# EAGLE design AlienWhoopF7 (EAGLE 9.0.0)
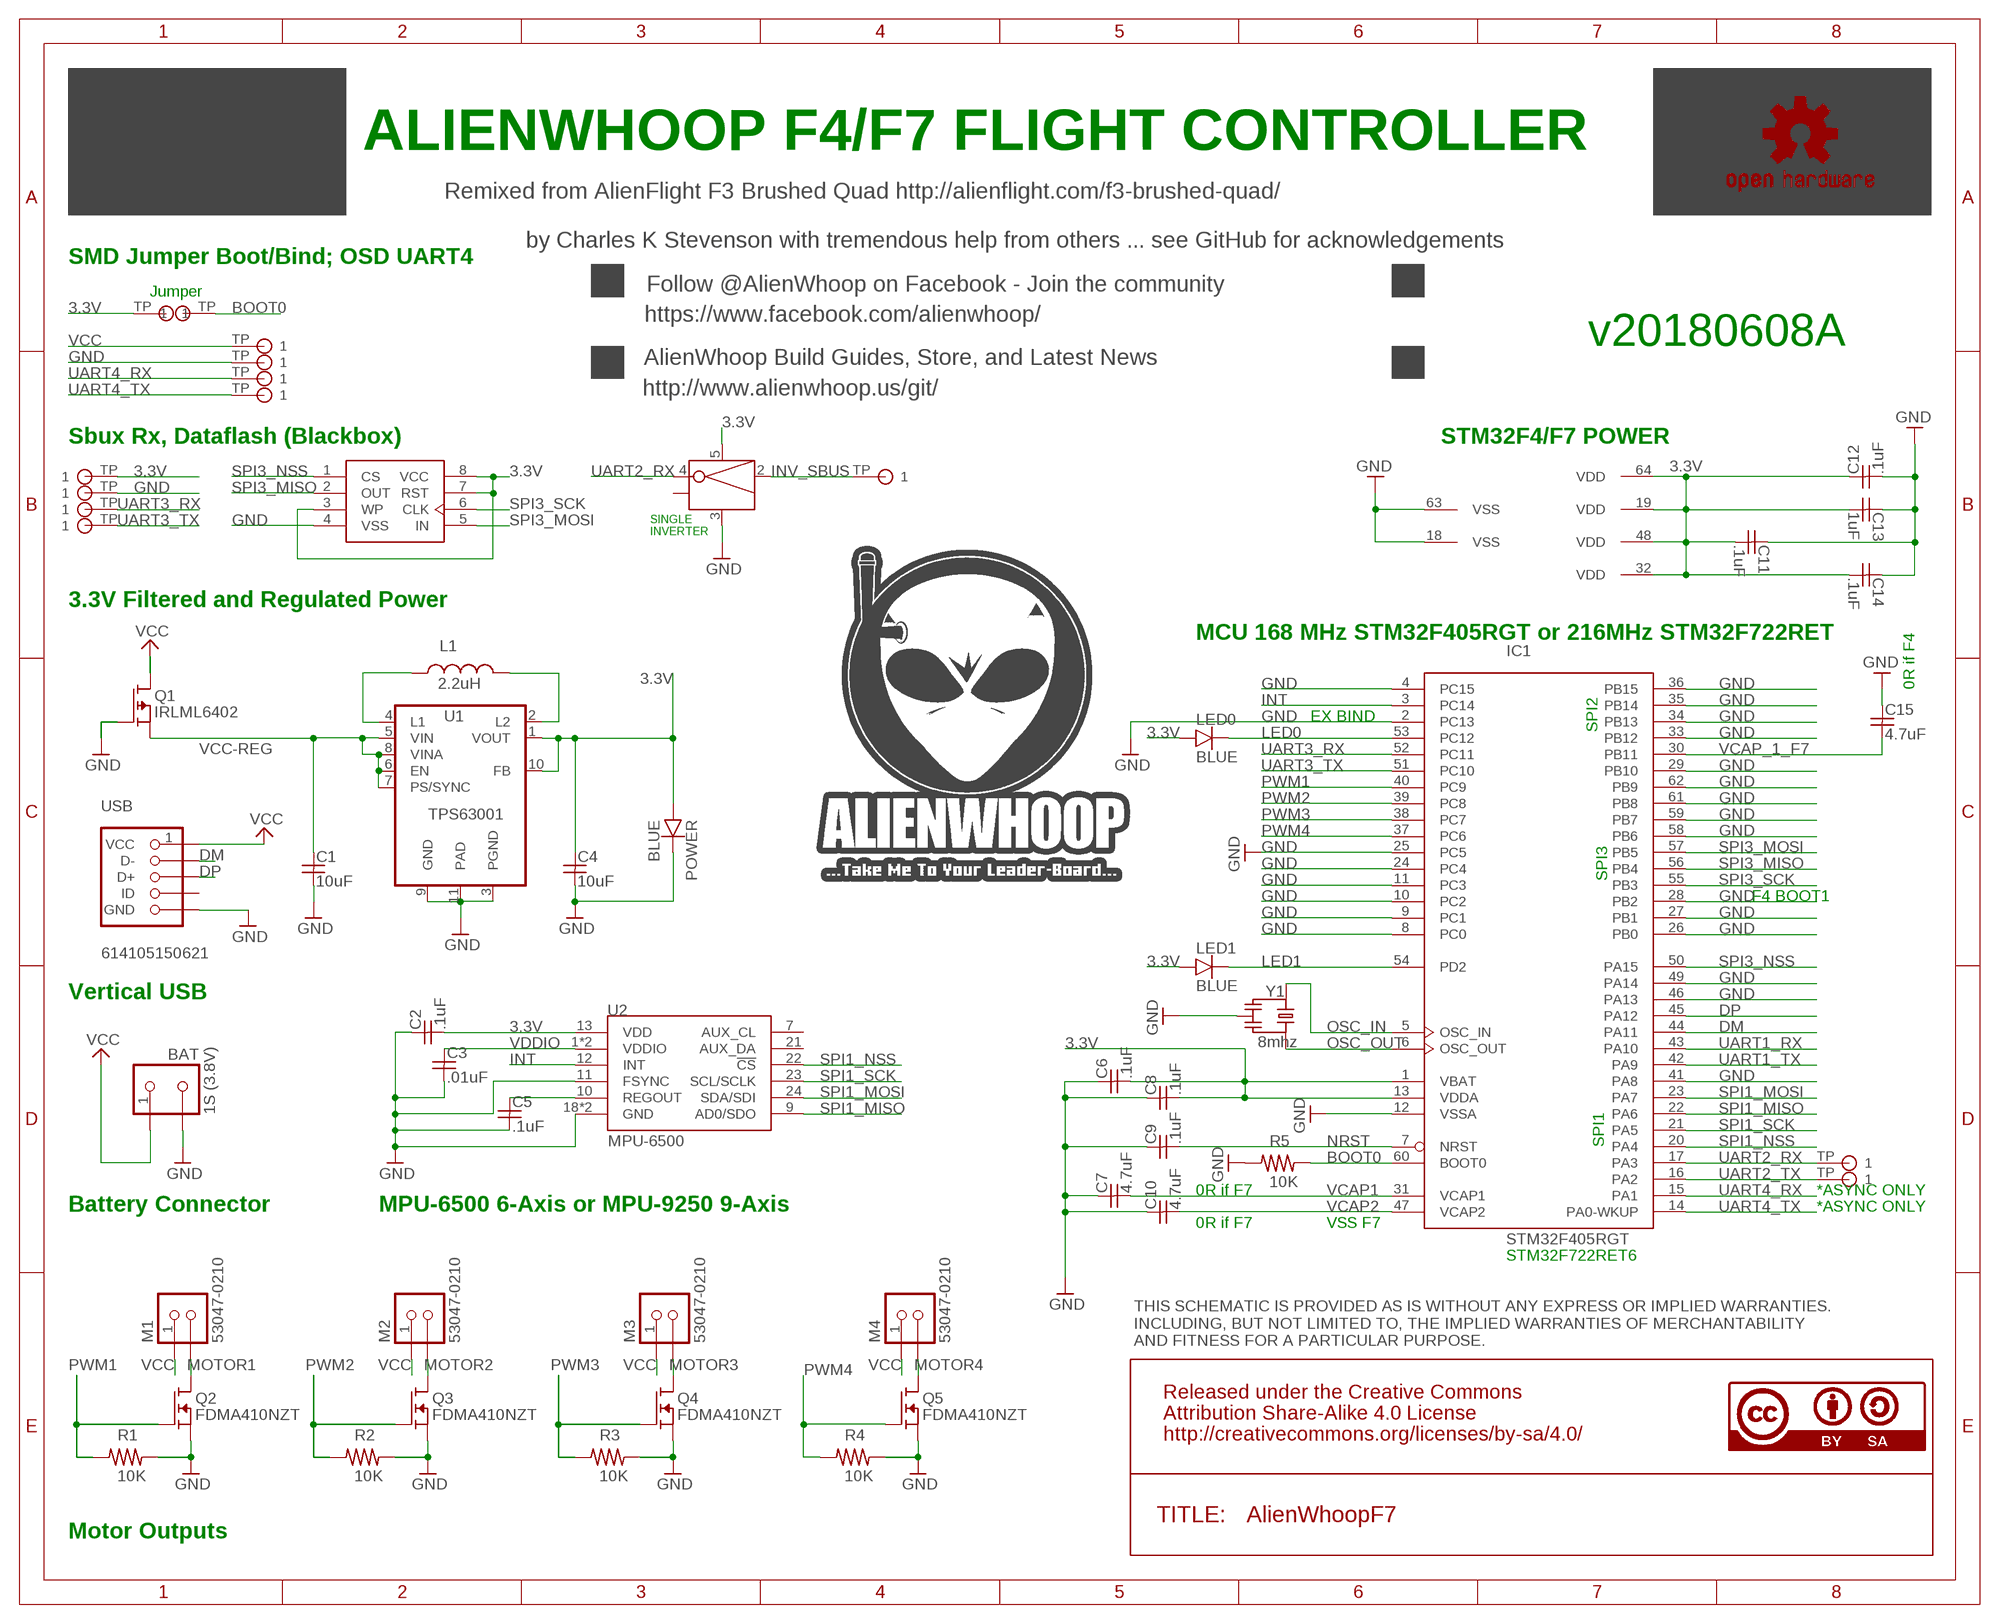
[diagram p0: schematic, sheet 1]

## Parts
3.3V  TESTPAD  [TESTPAD]
3V3  TESTPAD  [TESTPAD]
BAT  1S (3.8V)  JST-PH-BAT  [S2B-PH-K-S]
BOOT  TESTPAD  [TESTPAD]
C1  10uF  CAPACITOR10UF  [YUDEN-CAP-0805]
C2  .1uF  CAPACITOR.1UF  [MUR-CAP-0603]
C3  .01uF  CAPACITOR.01UF  [MUR-CAP-0603]
C4  10uF  CAPACITOR10UF  [YUDEN-CAP-0805]
C5  .1uF  CAPACITOR.1UF  [MUR-CAP-0603]
C6  .1uF  CAPACITOR.1UF  [MUR-CAP-0603]
C7  4.7uF  CAPACITOR4.7UF  [MUR-CAP-0603]
C8  .1uF  CAPACITOR.1UF  [MUR-CAP-0603]
C9  .1uF  CAPACITOR.1UF  [MUR-CAP-0603]
C10  4.7uF  CAPACITOR4.7UF  [MUR-CAP-0603]
C11  .1uF  CAPACITOR.1UF  [MUR-CAP-0603]
C12  .1uF  CAPACITOR.1UF  [MUR-CAP-0603]
C13  1uF  CAPACITOR1UF  [MUR-CAP-0603]
C14  .1uF  CAPACITOR.1UF  [MUR-CAP-0603]
C15  4.7uF  CAPACITOR4.7UF  [MUR-CAP-0603]
GND  TESTPAD  [TESTPAD]
GND@1  TESTPAD  [TESTPAD]
IC1  STM32F405RGT  [LQFP64]
L1  2.2uH  DFE201612E-2R2M-P2  [DFE201612E-2R2M-P2]
LED0  BLUE  SMD-CHIP-LED-0805  [SMD-CHIP-LED-0805]
LED1  BLUE  SMD-CHIP-LED-0805  [SMD-CHIP-LED-0805]
LOGO3  OSHW-LOGOS  [OSHW-LOGO-S]
M1  53047-0210  PICO-1.25-MOTOR  [PICO-53047-02]
M2  53047-0210  PICO-1.25-MOTOR  [PICO-53047-02]
M3  53047-0210  PICO-1.25-MOTOR  [PICO-53047-02]
M4  53047-0210  PICO-1.25-MOTOR  [PICO-53047-02]
POWER  BLUE  SMD-CHIP-LED-0805  [SMD-CHIP-LED-0805]
Q1  IRLML6402  MOSFET-P  [SOT-23]
Q2  FDMA410NZT  FDMA410NZ  [MICROFET-2X2]
Q3  FDMA410NZT  FDMA410NZ  [MICROFET-2X2]
Q4  FDMA410NZT  FDMA410NZ  [MICROFET-2X2]
Q5  FDMA410NZT  FDMA410NZ  [MICROFET-2X2]
R1  10K  RESISTOR10K  [VISH-RES-0603]
R2  10K  RESISTOR10K  [VISH-RES-0603]
R3  10K  RESISTOR10K  [VISH-RES-0603]
R4  10K  RESISTOR10K  [VISH-RES-0603]
R5  10K  RESISTOR10K  [VISH-RES-0603]
RX2  TESTPAD  [TESTPAD]
RX2/INV  TESTPAD  [TESTPAD]
RX3  TESTPAD  [TESTPAD]
RX4  TESTPAD  [TESTPAD]
TX2  TESTPAD  [TESTPAD]
TX3  TESTPAD  [TESTPAD]
TX4  TESTPAD  [TESTPAD]
U1  TPS63001  TPS630XX-TPS63001  [VSON-N10]
U2  MPU-6500  MPU-9250  [QFN24_PAD]
U3  MX25L6406EM2I-12G  M25P32  [M25P32]
U4  SN74LVC1G04DBVR  SN74LVC1G04  [SOT23-5]
USB  614105150621  MICROUSBUSB-BFPV  [USB-BFPV]
VCC@1  TESTPAD  [TESTPAD]
Y1  8mhz  RESONATOR8MHZ  [RESONATOR_8]

## Nets
3.3V: 3.3V.TP 3V3.TP C2.2 C4.1 C6.2 C8.2 C11.2 C12.1 C13.2 C14.2 IC1.1(VBAT) IC1.13(VDDA) IC1.19(VDD) IC1.32(VDD) IC1.48(VDD) IC1.64(VDD) LED0.A LED1.A POWER.A U1.1(VOUT) U1.10(FB) U2.13(VDD) U3.3(WP) U3.7(RST) U3.8(VCC) U4.5(VCC)
BOOT0: BOOT.TP IC1.60(BOOT0) R5.1
DM: IC1.44(PA11) USB.2(D-)
DP: IC1.45(PA12) USB.3(D+)
GND: BAT.2 C1.2 C2.1 C3.2 C4.2 C5.2 C6.1 C7.1 C8.1 C9.1 C10.1 C11.1 C12.2 C13.1 C14.1 C15.1 GND.TP GND@1.TP IC1.2(PC13) IC1.4(PC15) IC1.8(PC0) IC1.9(PC1) IC1.10(PC2) IC1.11(PC3) IC1.12(VSSA) IC1.18(VSS) IC1.24(PC4) IC1.25(PC5) IC1.26(PB0) IC1.27(PB1) IC1.28(PB2) IC1.29(PB10) IC1.33(PB12) IC1.34(PB13) IC1.35(PB14) IC1.36(PB15) IC1.41(PA8) IC1.46(PA13) IC1.49(PA14) IC1.58(PB6) IC1.59(PB7) IC1.61(PB8) IC1.62(PB9) IC1.63(VSS) POWER.C Q1.1(G) Q2.S Q2.S1(S) Q3.S Q3.S1(S) Q4.S Q4.S1(S) Q5.S Q5.S1(S) R1.1 R2.1 R3.1 R4.1 R5.2 U1.3(PGND) U1.9(GND) U1.11(PAD) U2.11(FSYNC) U2.18(GND) U2.20(GND) U3.4(VSS) U4.3(GND) USB.5(GND) USB.P$6(GND) USB.P$7(GND) Y1.2
INT: IC1.3(PC14) U2.12(INT)
INV_SBUS: RX2/INV.TP U4.2(A)
L1: L1.P$1 U1.4(L1)
L2: L1.P$2 U1.2(L2)
LED0: IC1.53(PC12) LED0.C
LED1: IC1.54(PD2) LED1.C
MOTOR1: M1.2 Q2.D Q2.D1(D) Q2.D2(D) Q2.D3(D) Q2.D4(D)
MOTOR2: M2.2 Q3.D Q3.D1(D) Q3.D2(D) Q3.D3(D) Q3.D4(D)
MOTOR3: M3.2 Q4.D Q4.D1(D) Q4.D2(D) Q4.D3(D) Q4.D4(D)
MOTOR4: M4.2 Q5.D Q5.D1(D) Q5.D2(D) Q5.D3(D) Q5.D4(D)
NRST: C9.2 IC1.7(NRST)
OSC_IN: IC1.5(OSC_IN) Y1.1
OSC_OUT: IC1.6(OSC_OUT) Y1.3
PWM1: IC1.40(PC9) Q2.G R1.2
PWM2: IC1.39(PC8) Q3.G R2.2
PWM3: IC1.38(PC7) Q4.G R3.2
PWM4: IC1.37(PC6) Q5.G R4.2
REGOUT: C5.1 U2.10(REGOUT)
SPI1_MISO: IC1.22(PA6) U2.9(AD0/SDO)
SPI1_MOSI: IC1.23(PA7) U2.24(SDA/SDI)
SPI1_NSS: IC1.20(PA4) U2.22(!CS)
SPI1_SCK: IC1.21(PA5) U2.23(SCL/SCLK)
SPI3_MISO: IC1.56(PB4) U3.2(OUT)
SPI3_MOSI: IC1.57(PB5) U3.5(IN)
SPI3_NSS: IC1.50(PA15) U3.1(CS)
SPI3_SCK: IC1.55(PB3) U3.6(CLK)
UART1_RX: IC1.43(PA10)
UART1_TX: IC1.42(PA9)
UART2_RX: IC1.17(PA3) RX2.TP U4.4(Y)
UART2_TX: IC1.16(PA2) TX2.TP
UART3_RX: IC1.52(PC11) RX3.TP
UART3_TX: IC1.51(PC10) TX3.TP
UART4_RX: IC1.15(PA1) RX4.TP
UART4_TX: IC1.14(PA0-WKUP) TX4.TP
VCAP1: C7.2 IC1.31(VCAP1)
VCAP2: C10.2 IC1.47(VCAP2)
VCAP_1_F7: C15.2 IC1.30(PB11)
VCC: BAT.1 M1.1 M2.1 M3.1 M4.1 Q1.3(D) USB.1(VCC) VCC@1.TP
VCC-REG: C1.1 Q1.2(S) U1.5(VIN) U1.6(EN) U1.7(PS/SYNC) U1.8(VINA)
VDDIO: C3.1 U2.1(VDDIO) U2.8(VDDIO)
Unconnected: U2.7(AUX_CL) U2.21(AUX_DA) U4.1 USB.4(ID)

## Notes on the sheet
- ALIENWHOOP F4/F7 FLIGHT CONTROLLER
- Remixed from AlienFlight F3 Brushed Quad http://alienflight.com/f3-brushed-quad/
- by Charles K Stevenson with tremendous help from others ... see GitHub for acknowledgements
- SMD Jumper Boot/Bind; OSD UART4
- Follow @AlienWhoop on Facebook - Join the community
- Jumper
- https://www.facebook.com/alienwhoop/
- v20180608A
- AlienWhoop Build Guides, Store, and Latest News
- http://www.alienwhoop.us/git/
- STM32F4/F7 POWER
- Sbux Rx, Dataflash (Blackbox)
- THIRD DRAFT
- 3.3V Filtered and Regulated Power
- MCU 168 MHz STM32F405RGT or 216MHz STM32F722RET
- 0R if F4
- SPI2
- EX BIND
- SPI3
- F4 BOOT1
- Vertical USB
- SPI1
- 0R if F7 | *ASYNC ONLY
- Battery Connector | MPU-6500 6-Axis or MPU-9250 9-Axis | *ASYNC ONLY
- 0R if F7 | VSS F7
- STM32F722RET6
- THIS SCHEMATIC IS PROVIDED AS IS WITHOUT ANY EXPRESS OR IMPLIED WARRANTIES.
  INCLUDING, BUT NOT LIMITED TO, THE IMPLIED WARRANTIES OF MERCHANTABILITY
  AND FITNESS FOR A PARTICULAR PURPOSE.
- Motor Outputs

## Library data of the parts
3.3V 3V3 BOOT GND GND@1 RX2 RX2/INV RX3 RX4 TX2-TX4 VCC@1 = AlienWhoop:TESTPAD: Test pad also can be used for tiny solder pad for signal; BOM: EXCLUDE; DNP: T; PARTNO: TESTPAD
BAT = alienflight:JST-PH-BAT: Battery Connector JST- S2B-PH-K-S View Datasheet <http://www.jst-mfg.com/product/pdf/eng/ePH.pdf> Author: Lance Source: http://alienflight.com License: CC BY SA <creativecommons.org/licenses/by-sa/4.0/>; BOM: EXCLUDE; DNP: T; MF: JST; MPN: S2B-PH-K-S
C1 C4 = alienflight:CAPACITOR: CAPACITORS Murata Datasheet <http://www.murata.com/~/media/webrenewal/support/library/catalog/products/capacitor/mlcc/c02e.ashx?la=en-us> Taiyo Yuden Datasheet <http://www.mouser.com/ds/2/396/mlcc11_hq_e-541564.pdf> Author: Lance Source: http://alienflight.com License: CC BY SA <creativecommons.org/licenses/by-sa/4.0/>; MF: Taiyo Yuden; MPN: JMK212AB7106KG-T
C2 C5 C6 C8 C9 C11 C12 C14 = alienflight:CAPACITOR: CAPACITORS Murata Datasheet <http://www.murata.com/~/media/webrenewal/support/library/catalog/products/capacitor/mlcc/c02e.ashx?la=en-us> Taiyo Yuden Datasheet <http://www.mouser.com/ds/2/396/mlcc11_hq_e-541564.pdf> Author: Lance Source: http://alienflight.com License: CC BY SA <creativecommons.org/licenses/by-sa/4.0/>; MF: Murata; MPN: GRM188R71C104KA01D
C3 = alienflight:CAPACITOR: CAPACITORS Murata Datasheet <http://www.murata.com/~/media/webrenewal/support/library/catalog/products/capacitor/mlcc/c02e.ashx?la=en-us> Taiyo Yuden Datasheet <http://www.mouser.com/ds/2/396/mlcc11_hq_e-541564.pdf> Author: Lance Source: http://alienflight.com License: CC BY SA <creativecommons.org/licenses/by-sa/4.0/>; MF: Murata; MPN: GRM188R71C103KA01D
C7 C10 C15 = alienflight:CAPACITOR: CAPACITORS Murata Datasheet <http://www.murata.com/~/media/webrenewal/support/library/catalog/products/capacitor/mlcc/c02e.ashx?la=en-us> Taiyo Yuden Datasheet <http://www.mouser.com/ds/2/396/mlcc11_hq_e-541564.pdf> Author: Lance Source: http://alienflight.com License: CC BY SA <creativecommons.org/licenses/by-sa/4.0/>; MF: Murata; MPN: GRJ188C70J475KE11D
C13 = alienflight:CAPACITOR: CAPACITORS Murata Datasheet <http://www.murata.com/~/media/webrenewal/support/library/catalog/products/capacitor/mlcc/c02e.ashx?la=en-us> Taiyo Yuden Datasheet <http://www.mouser.com/ds/2/396/mlcc11_hq_e-541564.pdf> Author: Lance Source: http://alienflight.com License: CC BY SA <creativecommons.org/licenses/by-sa/4.0/>; MF: Murata; MPN: GRM188R71C105KA12D
IC1 = micro-stm_v2:STM32F405R*T: ARM 32-bit Cortex™-M3 CPU 168 MHz maximum frequency 1024 Kbytes of Flash memory 192 kbytes of SRAM 51 GPIOs 1.8 to 3.6 V application supply; MPN: STM32F045RGT
L1 = AlienWhoop:DFE201612E-2R2M-P2: Murata Fixed Inductors 0806 2.2uH 20% 2.4A RDC=0.116ohms; PARTNO: DFE201612E-2R2M-P2
LED0 LED1 POWER = alienflight:SMD-CHIP-LED-0805: SMD CHIP LED APHCM2012QBC/D-F01 View Datasheet <https://www.kingbrightusa.com/images/catalog/spec/APHCM2012QBC-D-F01.pdf> Author: Lance Source: http://alienflight.com License: CC BY SA <creativecommons.org/licenses/by-sa/4.0/>; MF: Kingbright; MPN: APHCM2012QBC/D-F01
LOGO3 = SparkFun-Aesthetics:OSHW-LOGO: Open Source Hardware Logo This logo indicates the piece of hardware it is found on incorporates a OSHW license and/or adheres to the definition of open source hardware found here: http://freedomdefined.org/OSHW; BOM: EXCLUDE; DNP: T; PARTNO: OSHW-LOGOS
M1-M4 = alienflight:PICO-1.25-MOTOR: Motor Connector PicoBlade 1.25 53047-02 View Datasheet <http://www.molex.com/webdocs/datasheets/pdf/en-us/0530470210_PCB_HEADERS.pdf> Author: Lance Source: http://alienflight.com License: CC BY SA <creativecommons.org/licenses/by-sa/4.0/>; MF: MOLEX; MPN: 53047-0210
Q1 = alienflight:MOSFET-P: P-Channel MOSFET IRLML6402 Datasheet <http://www.irf.com/product-info/datasheets/data/irlml6402pbf.pdf> Author: Lance Source: Alienflight.com License: CC BY SA <creativecommons.org/licenses/by-sa/4.0/>; MF: IR; MPN: IRLML6402
Q2-Q5 = alienflight:FDMA410NZ: N-Channel MOSFET FDMA410NZ View Datasheet <https://www.fairchildsemi.com/datasheets/FD/FDMA410NZ.pdf> Author: Lance Source: http://alienflight.com License: CC BY SA <creativecommons.org/licenses/by-sa/4.0/>; MF: Fairchild; MPN: FDMA410NZ; PARTNO: FDMA410NZT; VALUE: FDMA410NZ
R1-R5 = alienflight:RESISTOR: RESISTORS Vishay DataSheet <http://www.vishay.com/docs/20043/crcwhpe3.pdf> Author: Lance Source: http://alienflight.com License: CC BY SA <creativecommons.org/licenses/by-sa/4.0/>; MF: Vishay; MPN: CRCW060310K0FKEAHP
U1 = alienflight:TPS630XX: Buck/Boost Converter TPS63001/2 Datasheet <http://www.ti.com/lit/ds/symlink/tps63001.pdf> Author: Lance Source: http://alienflight.com License: CC BY SA <creativecommons.org/licenses/by-sa/4.0/>; MF: TI; MPN: TPS63001DRCR
U2 = Sparkfun:MPU-9250: NC pin 19. 2-6 & 14-17 not internally connected. May be used for PCB trace routing.; PARTNO: MPU-6500; PROD_ID: IC-13192
U3 = AlienWhoop:M25P32: Dataflash; PARTNO: MX25L6406EM2I-12G
U4 = AlienWhoop:SN74LVC1G04: SN74LVC1G04 Single Inverter Gate; PARTNO: SN74LVC1G04DBVR
USB = AlienWhoop:MICROUSB: Molex USB Connectors uUSB B Rec Vertical TH 2.30; PARTNO: 614105150621
Y1 = alienflight:RESONATOR: SMD Ceramic Resonators Ceralock Murata Datasheet <http://www.murata.com/~/media/webrenewal/support/library/catalog/products/timingdevice/ceralock/p16e.ashx> Author: Lance Source: http://alienflight.com License: CC BY SA <creativecommons.org/licenses/by-sa/4.0/>; MF: Murata; MPN: CSTCE8M00G55-R0

## Board
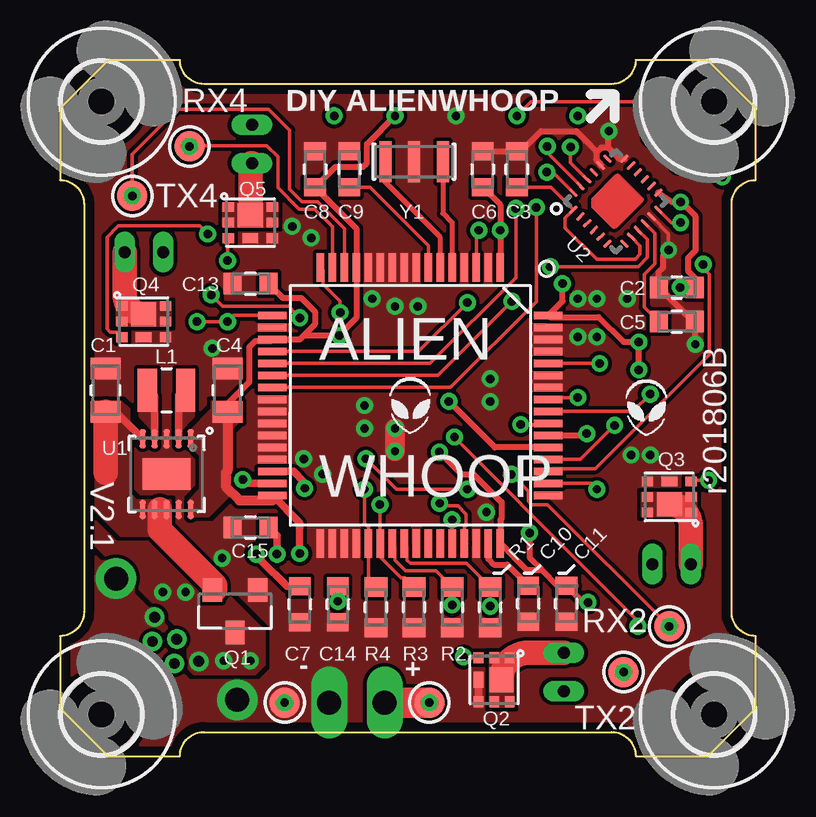
[diagram p1: board, top side]
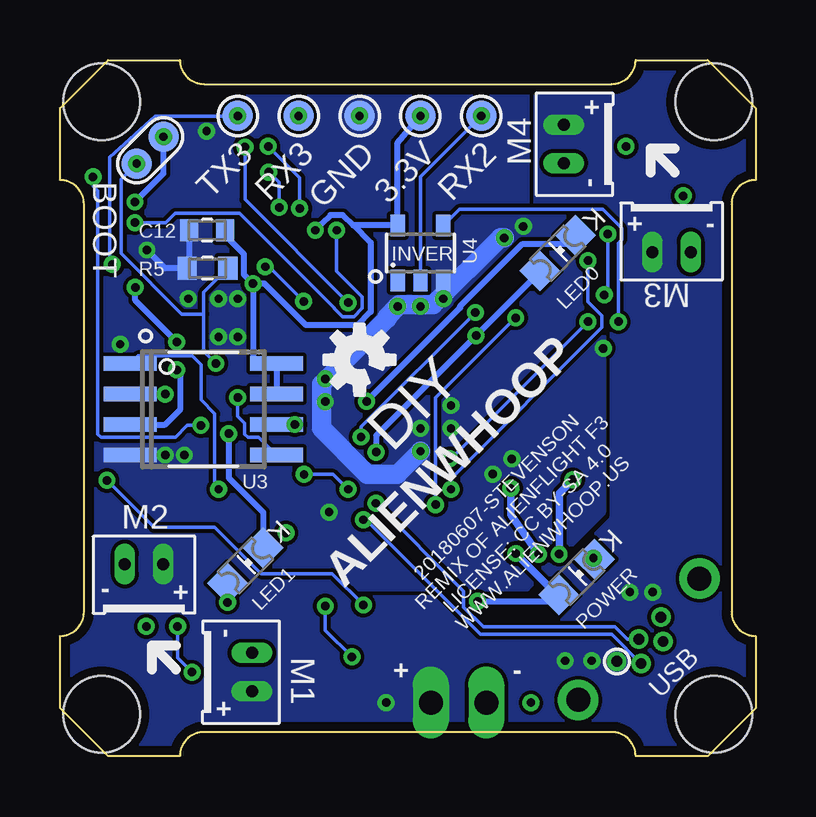
[diagram p2: board, bottom side, seen from below]

Size 29 x 29 mm. Coordinates in mm from the lower left corner, seen from the top.
Outline: 0,27 0,24 arc-90 1,23 1,6 arc-90 0,5 0,2 2,0 5,0 arc-90 6,1 23,1 arc-90 24,0 27,0 29,2 29,5 arc-90 28,6 28,23 arc-90 29,24 29,27 27,29 24,29 arc-90 23,28 6,28 arc-90 5,29 2,29 0,27
Copper layers (1*16): Top 0.0356mm / dielectric 1.5011mm / Bottom 0.0356mm
Design rules "oshpark-2layer *": minimum track width 6mil, minimum drill 13mil, track to track 6mil, track to pad 6mil, pad to pad 6mil, via to via 6mil, smd to smd 6mil, copper to edge 15mil, drill to drill 6mil, minimum pad ring 7mil, minimum via ring 7mil, stop-mask expansion 2.5mil, vias tented up to drill 24mil, thermal gap 10mil

### Footprints (pad centres in the part's own frame; a part is rotated, then mirrored left to right if it is on the bottom)
TESTPAD = smd 1.27 x 1.27: TP 0,0
S2B-PH-K-S = drill 1 long: 1 1.159,0; 2 -1.159,0
YUDEN-CAP-0805 = smd 0.9 x 1.25: 1 -0.9,0; 2 0.9,0
MUR-CAP-0603 = smd 0.75 x 0.9: 1 -0.75,0; 2 0.75,0
LQFP64 = smd 0.3 x 1.2: 1 -3.75,-5.75; 2 -3.25,-5.75; 3 -2.75,-5.75; 4 -2.25,-5.75; 5 -1.75,-5.75; 6 -1.25,-5.75; 7 -0.75,-5.75; 8 -0.25,-5.75; 9 0.25,-5.75; 10 0.75,-5.75; 11 1.25,-5.75; 12 1.75,-5.75; 13 2.25,-5.75; 14 2.75,-5.75; 15 3.25,-5.75; 16 3.75,-5.75; 33 3.75,5.75; 34 3.25,5.75; 35 2.75,5.75; 36 2.25,5.75; 37 1.75,5.75; 38 1.25,5.75; 39 0.75,5.75; 40 0.25,5.75; 41 -0.25,5.75; 42 -0.75,5.75; 43 -1.25,5.75; 44 -1.75,5.75; 45 -2.25,5.75; 46 -2.75,5.75; 47 -3.25,5.75; 48 -3.75,5.75 | smd 1.2 x 0.3: 17 5.75,-3.75; 18 5.75,-3.25; 19 5.75,-2.75; 20 5.75,-2.25; 21 5.75,-1.75; 22 5.75,-1.25; 23 5.75,-0.75; 24 5.75,-0.25; 25 5.75,0.25; 26 5.75,0.75; 27 5.75,1.25; 28 5.75,1.75; 29 5.75,2.25; 30 5.75,2.75; 31 5.75,3.25; 32 5.75,3.75; 49 -5.75,3.75; 50 -5.75,3.25; 51 -5.75,2.75; 52 -5.75,2.25; 53 -5.75,1.75; 54 -5.75,1.25; 55 -5.75,0.75; 56 -5.75,0.25; 57 -5.75,-0.25; 58 -5.75,-0.75; 59 -5.75,-1.25; 60 -5.75,-1.75; 61 -5.75,-2.25; 62 -5.75,-2.75; 63 -5.75,-3.25; 64 -5.75,-3.75
DFE201612E-2R2M-P2 = smd 0.8 x 1.8: P$1 -0.8,0; P$2 0.8,0
SMD-CHIP-LED-0805 = smd 1.2 x 1.2: A -1.05,0; C 1.05,0
PICO-53047-02 = drill 0.5 pad 0.813 long: 1 0.8,0; 2 -0.8,0
SOT-23 = smd 0.802 x 0.972: 1 -0.95,-0.885; 2 0.95,-0.885; 3 0,0.885
MICROFET-2X2 = smd 1 x 1.05: D -0.3,0 | smd 0.4 x 0.47: D1 -0.65,0.915; D2 0,0.915; D3 -0.65,-0.915; D4 0,-0.915; G 0.65,-0.915; S1 0.65,0.915 | smd 0.4 x 0.66: S 0.65,0
VISH-RES-0603 = smd 0.8 x 0.95: 1 -0.85,0; 2 0.85,0
VSON-N10 = smd 0.8 x 0.26: 1 -1.475,1; 2 -1.475,0.5; 3 -1.475,0; 4 -1.475,-0.5; 5 -1.475,-1; 6 1.475,-1; 7 1.475,-0.5; 8 1.475,0; 9 1.475,0.5; 10 1.475,1 | smd 1.3 x 2: 11 0,0
QFN24_PAD = smd 0.457 x 0.152: 1 -1.5,1; 2 -1.5,0.6; 3 -1.5,0.2; 4 -1.5,-0.2; 5 -1.5,-0.6; 6 -1.5,-1; 13 1.5,-1; 14 1.5,-0.6; 15 1.5,-0.2; 16 1.5,0.2; 17 1.5,0.6; 18 1.5,1 | smd 0.152 x 0.457: 7 -1,-1.5; 8 -0.6,-1.5; 9 -0.2,-1.5; 10 0.2,-1.5; 11 0.6,-1.5; 12 1,-1.5; 19 1,1.5; 20 0.6,1.5; 21 0.2,1.5; 22 -0.2,1.5; 23 -0.6,1.5; 24 -1,1.5
M25P32 = smd 0.6 x 2.2: 1 -1.905,-3.048; 2 -0.635,-3.048; 3 0.635,-3.048; 4 1.905,-3.048; 5 1.905,3.048; 6 0.635,3.048; 7 -0.635,3.048; 8 -1.905,3.048
SOT23-5 = smd 0.6 x 0.9: 1 -0.95,-1.15; 2 0,-1.15; 3 0.95,-1.15; 4 0.95,1.15; 5 -0.95,1.15
3,2 = hole 3.2: 0,0
USB-BFPV = drill 0.45 pad 0.813: 1 -1.3,0; 2 -0.65,-0.78; 3 0,0; 4 0.65,-0.78; 5 1.3,0 | drill 1 pad 1.676: P$6 -3.575,0; P$7 3.575,0
RESONATOR_8 = smd 0.5 x 1.7: 1 -1.2,0; 2 0,0; 3 1.2,0

### Placement (x,y rotation side)
3.3V  13.97,26.67 270 bottom
3V3  24.68,25.8 225 bottom
BAT  12.38,2.22 180 bottom
BOOT  25.8,24.68 135 bottom
C1  1.91,15.24 90 top
C2  25.72,19.53 0 top
C3  19.05,24.45 90 top
C4  6.99,15.24 90 top
C5  25.72,18.1 0 top
C6  17.62,24.45 270 top
C7  10,6.32 90 top
C8  10.64,24.45 270 top
C9  12.06,24.45 270 top
C10  19.53,6.35 90 top
C11  21.11,6.35 90 top
C12  22.86,21.91 180 bottom
C13  7.94,19.68 0 top
C14  11.59,6.32 90 top
C15  7.94,9.52 0 top
GND  16.51,26.67 270 bottom
GND@1  9.37,2.22 0 top
IC1  14.61,14.61 180 top
L1  4.45,15.24 0 top
LED0  8.26,20.95 45 bottom
LED1  21.27,7.94 45 bottom
LOGO3  16.51,16.51 45 bottom
M1  21,3.5 270 bottom
M2  25.5,8 0 bottom
M3  3.5,21 180 bottom
M4  8,25.5 90 bottom
POWER  7.46,7.46 45 bottom
Q1  7.3,6.03 180 top
Q2  18.1,3.17 180 top
Q3  25.4,10.79 90 top
Q4  3.49,18.1 270 top
Q5  7.94,22.23 270 top
R1  17.94,6.19 90 top
R2  16.35,6.19 90 top
R3  14.76,6.19 90 top
R4  13.18,6.19 90 top
R5  22.85,20.32 180 bottom
RX2  25.4,5.4 0 top
RX2/INV  11.43,26.67 0 bottom
RX3  19.05,26.67 270 bottom
RX4  5.4,25.4 0 top
TX2  23.5,3.49 0 top
TX3  21.59,26.67 270 bottom
TX4  3.02,23.34 0 top
U1  4.45,11.75 270 top
U2  23.18,23.12 45 top
U3  23.02,14.45 270 bottom
U4  13.97,20.95 0 bottom
U$1  [3,2]  1.74,27.27 0 top
U$2  [3,2]  27.27,27.27 0 top
U$3  [3,2]  27.27,1.74 0 top
U$4  [3,2]  1.74,1.74 0 top
USB  4.87,4.87 45 bottom
VCC@1  15.4,2.22 0 top
Y1  14.76,24.77 180 top

### Tracks (layer width: path | path; a pad name or v marks a point on that pad's centre or on a via)
3.3V  (via drill 0.35)
  Top 0.203: 26.51,21.11 26.51,21.03
  Top 0.254: 20.09,7.75 19.46,7.75 IC1.48 18.36,9.84 18.41,9.9 18.41,10.58 17.25,11.74 16.73,11.74 v15.81,12.66 | 20.09,7.75 20.75,7.1 C11.2 21.81,6.4 v22.02,6.4 | U2.13 25.55,23.08 v25.88,23.08 26.1,22.86 26.14,22.86 26.51,22.49 26.51,21.11 26.51,21.07 26.18,20.74 26.18,20.22 26.51,19.9 26.51,19.57 C2.2 v25.86,19.53 | v20.95,19.68 20.95,18.95 IC1.64 20.43,18.28 22.46,18.28 23.49,17.25 v24.13,17.25 v24.13,16.09 | C6.2 18.36,22.96 v18.36,21.91 IC1.1 | v19.58,9.29 19.58,8.27 20.09,7.75 | C4.1 6.99,14.67 7.89,15.57 7.89,17.04 8.14,17.28 8.78,17.28 IC1.19 10,17.36 | C13.2 9.28,19.09 10.06,19.09 10.63,18.52 10.63,17.99 10,17.36 | 10,17.36 10.16,17.51 v11.65,17.51 11.65,17.55 12.36,18.26 IC1.13 12.36,21.98 C8.2 11.48,24.54 12.63,24.54 12.79,24.71 12.79,25.49 3.3V.TP | C14.2 v11.59,6.45 | 8.86,10.65 IC1.32
  Top 0.305: 6.56,14.34 C4.1 | C11.2 21.48,7.1 | v10,8.44 10,9.71 IC1.32
  Top 0.406: C4.1 6.99,11.88 6.91,11.81 6.91,11.22 7.48,10.65 8.86,10.65
  Bottom 0.254: v25.88,23.08 24.68,24.28 3V3.TP | 9,20.15 LED0.A 9,20.17 v11.65,17.51 15.81,13.35 v15.81,12.66 | v20.95,19.68 20.95,16.41 U3.8 U3.7 | v20.95,19.68 20.48,19.68 18.74,17.95 16.6,17.95 16.05,18.5 16.05,21.39 16.77,22.11 | v18.36,21.91 18.09,22.17 17.72,22.54 17.2,22.54 16.77,22.11 | 3.3V.TP 14.92,25.56 U4.5 16.77,22.11 | LED1.A v22.02,6.4 | v11.59,6.45 8.55,6.45 8.28,6.72 | v20.95,19.68 21.32,20.05 21.32,20.91 22.11,21.7 C12.1 | v24.13,17.25 25.86,18.98 v25.86,19.53 | U3.3 24.61,13.81 23.97,14.45 23.97,15.93 v24.13,16.09
  Bottom 0.305: v10,8.44 8.28,6.72 POWER.A
  other vias: 13.97,26.67 24.68,25.8
  pour Top (no thermals): 5.4,13.49 5.4,13.02 5.87,12.54 5.87,11.11 5.4,10.64 5.4,10 6.19,10 6.99,10.79 6.99,13.49 7.46,13.97 7.46,14.76 6.35,14.76 6.35,14.45
BOOT0  (via drill 0.35)
  Top 0.152: 22.07,16.36 IC1.60 v22.5,16.36
  Bottom 0.152: v22.5,16.36 23.01,16.86 23.01,18.41 | BOOT.TP 26.46,24.02 26.46,21.27 26.46,20.95 23.93,18.41 23.01,18.41 | 23.01,18.41 23.01,19.32 R5.1
  other vias: 25.8,24.68
DM  (via drill 0.35)
  Top 0.152: v16.35,9.84 IC1.44
  Bottom 0.152: USB.2 6,5.08 11.48,5.08 16.24,9.84 v16.35,9.84
DP  (via drill 0.35)
  Top 0.152: 16.98,8.86 IC1.45 16.86,9.52 16.93,9.6 16.93,10.08 16.59,10.42 15.93,10.42 v15.83,10.53
  Bottom 0.152: USB.3 5.35,4.87 5.87,5.38 11.35,5.38 12.17,6.21 12.17,6.88 v15.83,10.53
GND  (via drill 0.35)
  Top 0.152: 20.28,17.78 IC1.63 | v25.38,21.08 25.38,21.77 U2.11
  Top 0.254: C6.1 C3.2 19.22,25.2 20.06,26.03 21.52,26.03 21.92,25.64 21.92,25.63 22.36,25.19 22.36,25.14 | v26.49,17.16 26.49,18.07 | 26.49,18.07 C5.2 | 22.86,25.35 22.57,25.35 22.36,25.14 | 22.36,25.14 22.36,24.84 22.54,24.66 U2.20 | U2.18 23.33,24.88 22.86,25.35 | 22.86,25.35 22.86,26.02 v22.89,26.04 | v25.38,21.08 25.15,20.86 25.15,20.35 24.97,20.17 C2.1 26.42,18.07 26.49,18.07
  Top 0.305: Q2.S Q2.S1 | 4.95,11.25 U1.11
  Top 0.813: v13.97,12.7 v13.97,13.65
  Bottom 0.152: U4.3 v13.02,19.05 | 23.59,21.91 C12.2
  Bottom 0.254: U3.4 v24.61,12.54 | C12.2 23.61,20.42 R5.2 24.61,20.32 v25.38,21.08
  Bottom 0.305: POWER.C v6.76,8.25
  Bottom 0.813: v10.48,21.59 10.64,21.59 13.44,18.8 14.86,18.8 v14.92,18.73 15.36,18.29 15.36,18.22 18.09,15.49 18.09,13.65 16.19,11.75 14.92,11.75 v13.97,12.7
  other vias: 9.37,2.22 16.51,26.67 10.16,12.38 10.95,11.75 21.59,17.46 22.38,17.46 21.59,19.05 22.38,19.05 23.81,12.54 13.97,18.73 6.35,16.99 17.78,10.16 9.68,22.07 12.7,13.65 12.7,14.61 23.65,19.05 17.94,15.72 17.94,14.76
  pour Top (rank 3, no thermals): -1,30 -1,-1 30,-1 30,30
  pour Top (no thermals): 3.17,17.62 3.17,16.83 1.11,16.83 1.11,15.24 3.02,15.24 3.02,16.35 4.29,16.35 6.03,16.35 6.03,15.4 7.94,15.4 7.94,17.94 5.08,17.94 4.76,17.62
  pour Bottom (no thermals): 6.35,10.16 6.35,22.86 9.53,22.86 9.53,29.21 29.21,29.21 29.21,9.53 22.86,9.53 22.86,6.99 9.53,6.99
INT  (via drill 0.35)
  Top 0.152: IC1.3 17.36,21.8 v17.46,21.91 | U2.12 25.48,22.23 v25.88,22.23
  Bottom 0.152: v25.88,22.23 24.59,22.23 24.2,22.61 21.51,22.61 17.57,18.67 17.57,18.65 17.23,18.31 16.75,18.31 16.41,18.65 16.41,19.13 17.46,20.19 v17.46,21.91
INV_SBUS  (via drill 0.35)
  Bottom 0.152: U4.2 13.97,24.13 RX2/INV.TP
  other vias: 11.43,26.67
L1
  Top 0.305: U1.4 3.94,14.94 arc90 L1.P$1
  pour Top (no thermals): 3.33,16.03 3.33,14.45 3.33,14.13 3.81,13.65 3.97,13.65 3.97,16.03
L2
  Top 0.305: U1.2 4.95,14.94 arc-90 L1.P$2
  pour Top (no thermals): 4.92,16.03 5.56,16.03 5.56,14.45 5.56,14.13 4.92,13.49
LED0  (via drill 0.35)
  Top 0.254: v16.21,14.77 18.13,12.86 IC1.53
  Bottom 0.254: LED0.C 7.87,21.34 9.72,21.34 12.32,18.74 12.32,18.67 v16.21,14.77
LED1  (via drill 0.35)
  Top 0.254: IC1.54 21.88,13.36 v21.96,13.43
  Bottom 0.254: v21.96,13.43 21.96,11.58 20.53,10.15 LED1.C
MOTOR1
  Top 1.016: Q2.D arc-90 19.52,4.3 M1.2
  pour Top (no thermals): 17.94,4.29 18.89,4.29 18.89,2.06 17.94,2.06
MOTOR2
  Top 1.016: M2.2 26.3,9.6 arc90 Q3.D
  pour Top (no thermals): 24.29,10 26.51,10 26.51,10.95 24.29,10.95
MOTOR3
  Top 1.016: Q4.D arc-90 2.7,19.19 M3.2
  pour Top (no thermals): 2.38,17.94 4.6,17.94 4.6,18.89 2.38,18.89
MOTOR4
  Top 1.016: M4.2 arc90 7.94,24.64 Q5.D
  pour Top (no thermals): 6.83,23.02 6.83,22.07 9.05,22.07 9.05,23.02
NRST
  Top 0.152: 12.37,23.39 C9.2 12.93,23.7 15.36,21.27 IC1.7
OSC_IN
  Top 0.203: IC1.5 16.35,22.23 15.96,22.61 Y1.1
OSC_OUT
  Top 0.203: Y1.3 13.56,23.9 15.86,21.61 IC1.6
PWM1  (via drill 0.35)
  Top 0.152: IC1.40 14.48,8.73 14.48,8.16 14.61,8.03 16.95,8.03 R1.2 v17.94,6.25 | v16.83,4.13 16.86,4.09 Q2.G
  Bottom 0.152: v17.94,6.25 17.94,5.24 v16.83,4.13
PWM2  (via drill 0.35)
  Top 0.152: IC1.39 13.98,8.73 13.98,8.16 14.41,7.72 15.67,7.72 R2.2 v16.35,6.29 | v27.04,11.48 26.35,11.48 Q3.G
  Bottom 0.152: v16.35,6.29 17.66,7.6 20.62,7.6 22.55,9.53 25.08,9.53 v27.04,11.48
PWM3  (via drill 0.35)
  Top 0.152: R3.2 14.39,7.42 14.22,7.42 13.36,8.28 IC1.38 13.34,8.88 v13.34,10.48 | Q4.G 2.36,17.66 2.1,17.66 1.96,17.8 1.96,21.62 2.43,22.08 5.82,22.08 v6.16,21.75 | v6.31,19.21 6.73,18.79 6.79,18.73 9.55,18.73 9.68,18.6 9.68,18.57 v10,18.26
  Bottom 0.152: v10,18.26 13.34,14.92 v13.34,10.48 | v6.16,21.75 6.16,19.36 v6.31,19.21
PWM4  (via drill 0.35)
  Top 0.152: R4.2 12.86,7.36 IC1.37 12.86,9.53 12.7,9.68 v12.7,11.11 | v6.99,20.64 6.99,21.54 Q5.G
  Bottom 0.152: v6.99,20.64 6.99,18.92 6.4,18.34 6.4,17.86 12.7,11.56 v12.7,11.11
REGOUT
  Top 0.152: C5.1 24.36,18.7 24.36,20.07 24.79,20.5 24.79,21.78 U2.10
SPI1_MISO  (via drill 0.35)
  Top 0.152: v20.44,20.39 24.1,20.39 arc90 24.11,20.39 24.49,20.77 24.49,21.52 U2.9 | IC1.22 15.75,15.86 v18.84,18.94
  Bottom 0.152: v20.44,20.39 20.28,20.39 v18.84,18.94
SPI1_MOSI  (via drill 0.35)
  Top 0.152: 21.35,23.53 21.34,23.53 21.36,23.5 21.36,23.52 U2.24 20.55,24.33 v20.3,24.33 | v19.86,22.86 19.86,18.93 16.28,15.36 IC1.23
  Bottom 0.152: v19.86,22.86 19.86,23.9 v20.3,24.33
SPI1_NSS  (via drill 0.35)
  Top 0.152: 8.76,16.76 arc90 IC1.20 14.95,16.86 v16.99,18.89 | v21.29,25.38 21.29,24.73 U2.22 | U2.22
  Bottom 0.152: v21.29,25.38 21.29,23.19 v16.99,18.89
SPI1_SCK  (via drill 0.35)
  Top 0.152: 8.81,16.31 arc90 IC1.21 15.43,16.36 19,19.93 v19,22.82 | U2.23 20.32,25.13 v20.32,25.4
  Bottom 0.152: v20.32,25.4 19,24.08 v19,22.82
SPI3_MISO  (via drill 0.35)
  Top 0.152: IC1.56 23.88,14.36 v24.61,15.08
  Bottom 0.152: v24.61,15.08 U3.2
SPI3_MOSI  (via drill 0.35)
  Top 0.152: v21.59,14.94 20.44,14.94 IC1.57
  Bottom 0.152: v21.59,14.94 21.59,14.16 21.3,13.87 21.3,13.42 21.16,13.28 20.71,13.28 U3.5
SPI3_NSS  (via drill 0.35)
  Top 0.152: IC1.50 22.14,11.36 v22.38,11.11
  Bottom 0.152: v22.38,11.11 22.54,11.27 22.54,14.26 23.12,14.84 23.12,16.3 23.5,16.67 25.75,16.67 U3.1
SPI3_SCK  (via drill 0.35)
  Top 0.152: v19.21,13.81 20.31,13.81 IC1.55
  Bottom 0.152: U3.6 v19.21,13.81
UART2_RX  (via drill 0.35)
  Top 0.152: IC1.17 7.24,18.36 v6.99,18.1 v5.71,18.1 | RX2.TP | RX2.TP 20.32,10.48 19.66,10.48 19.53,10.61 19.53,11.03 v18.82,11.74 | v12.75,12.38 14.03,11.11 v16.99,11.11
  Bottom 0.152: v5.71,18.1 5.71,21.37 5.58,21.51 5.58,21.99 6.36,22.77 12.35,22.77 U4.4 | v6.99,18.1 12.7,12.38 v12.75,12.38 | v16.99,11.11 17.61,11.74 v18.82,11.74
  other vias: 25.4,5.4
UART2_TX  (via drill 0.35)
  Top 0.152: IC1.16 10.98,20.23 10.98,19.66 11.68,18.95 v11.68,18.48 | v16.45,13.29 19.22,10.52 19.22,10.48 24.1,5.61 v24.1,5.4
  Bottom 0.152: v24.1,5.4 24.1,4.1 TX2.TP | v11.68,18.48 16.45,13.71 v16.45,13.29
  other vias: 23.5,3.49
UART3_RX  (via drill 0.35)
  Top 0.152: v23.12,13.77 21.7,12.36 IC1.52 | RX3.TP 19.63,27.25 22.07,27.25 22.23,27.25 24.5,27.25 25.21,26.55 25.21,26.41 26.41,25.21 26.55,25.21 v27.62,24.13
  Bottom 0.152: v27.62,24.13 27.62,23.75 27.42,23.55 27.42,13.42 27.29,13.28 24.18,13.28 23.69,13.77 v23.12,13.77
  other vias: 19.05,26.67
UART3_TX  (via drill 0.35)
  Top 0.152: IC1.51 20.48,11.98 22.32,11.98 27.07,16.72 27.07,20.07 26.82,20.32 v26.82,20.48
  Bottom 0.152: v26.82,20.48 arc-90 26.92,20.54 26.92,24.94 25.04,26.67 TX3.TP
  other vias: 21.59,26.67
UART4_RX  (via drill 0.35)
  Top 0.152: IC1.15 11.36,22.05 10.61,22.79 9.96,22.79 9.08,23.67 9.08,24.97 8.62,25.44 5.43,25.44 RX4.TP
  other vias: 5.4,25.4
UART4_TX  (via drill 0.35)
  Top 0.152: IC1.14 11.86,21.98 10.74,23.09 10.09,23.09 9.58,23.61 9.58,26.08 8.7,26.96 4.89,26.96 3.02,25.08 TX4.TP 3.04,23.36 3.21,23.36
  other vias: 3.02,23.34
VCAP1  (via drill 0.35)
  Top 0.305: v7.62,11.51 7.78,11.36 IC1.31 | v8.19,8.41 8.39,8.21 8.39,8.14 9.46,7.07 C7.2
  Bottom 0.305: v7.62,11.51 8.19,10.95 v8.19,8.41
VCAP2
  Top 0.152: 17.78,8.78 IC1.47
  Top 0.254: C10.2 18.65,7.98 18.09,7.98 17.86,8.21 IC1.47
VCAP_1_F7  (via drill 0.35)
  Top 0.305: IC1.30 9.73,11.86 10.2,11.39 v10.2,11.15 | v9.04,8.41 9.04,9.17 C15.2
  Bottom 0.305: v9.04,8.41 10.2,10.05 v10.2,11.15
VCC  (via drill 0.35)
  Top 1.27: BAT.1 VCC@1.TP
  other vias: 15.4,2.22 4.29,6.83 5.24,6.83 6.83,3.97 7.94,3.97
  pour Bottom (isolate 0.076, rank 2, no thermals): -2,31 -2,-2 31,-2 31,31
  pour Top (rank 2, no thermals): 1.27,10.16 1.27,9.02 5.33,4.95 5.33,3.68 5.59,3.43 8.13,3.43 8.38,3.68 8.51,3.81 8.51,5.21 4.7,9.02 2.54,9.02 1.4,10.16
VCC-REG
  Top 0.305: U1.5 2.33,14.34 C1.1 | Q1.2 6.36,7 6.47,7.11
  Top 1.016: C1.1 1.91,11.81 | 6.47,6.96 6.47,7.11 4.16,9.42 4.16,10.27
  pour Top (no thermals): 1.27,14.76 2.54,14.76 2.86,14.45 2.86,10.95 3.17,10.64 3.33,10.64 4.6,10.64 4.6,9.68 4.13,9.21 3.65,9.21 2.54,9.21 1.27,10.48
VDDIO
  Top 0.152: U2.8 24.18,21.26 24.18,20.9 23.98,20.7 22.38,20.7 21.06,22.01 21.06,22.41 U2.1 20.48,23.7 C3.1

### Text on the board
tPlace: DIY ALIENWHOOP | ALIEN | r201806B | V2.1 | WHOOP
bPlace: RX2 | K | INVER | ALIENWHOOP | DIY | K | 20180607-STEVENSON / REMIX OF ALIENFLIGHT F3 / LICENSE: CC BY-SA 4.0 / WWW.ALIENWHOOP.US | K | USB
Guide: Released under the Creative Commons Attribution-ShareAlike 4.0 International License / https://creativecommons.org/licenses/by-sa/4.0/ | THIS BOARD DESIGN IS PROVIDED AS IS WITHOUT ANY EXPRESS OR IMPLIED WARRANTIES. / INCLUDING, BUT NOT LIMITED TO, THE IMPLIED WARRANTIES OF MERCHANTABILITY AND / FITNESS FOR A PARTICULAR PURPOSE. | Remixed from the AlienFlight F3 brushed quad by Charles Stevenson / Lance's original work available at http://alienflight.com/f3-brushed-quad/ | WWW.ALIENWHOOP.US